# EAGLE design jphy_v2 (EAGLE 6.0)
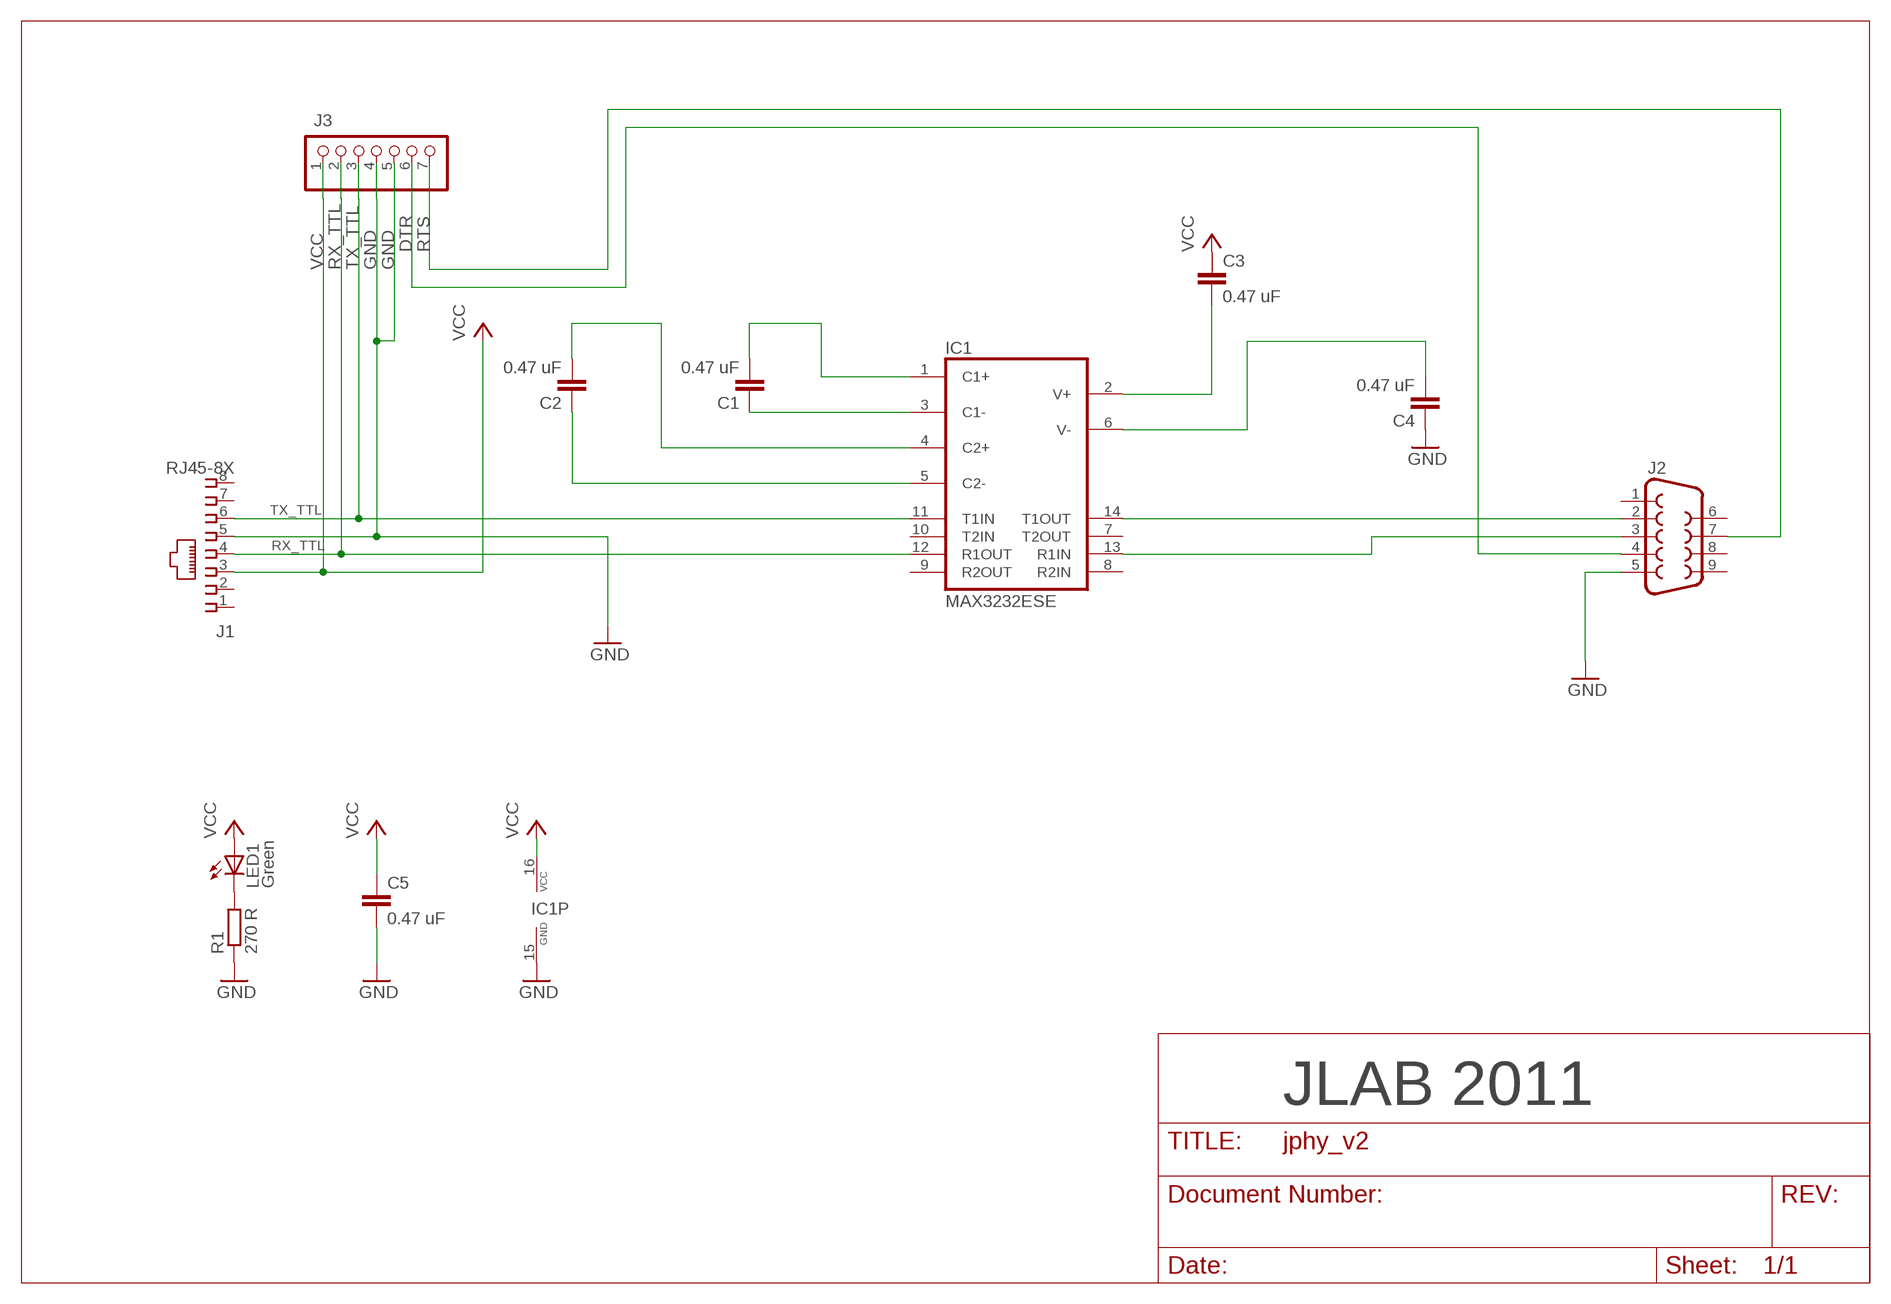
[diagram p0: schematic, sheet 1]

## Parts
C1  0.47 uF  C-EUC1206  [C1206]
C2  0.47 uF  C-EUC1206  [C1206]
C3  0.47 uF  C-EUC1206  [C1206]
C4  0.47 uF  C-EUC1206  [C1206]
C5  0.47 uF  C-EUC1206  [C1206]
IC1  MAX3232ESE  [SO16]
J1  RJ45-8X  [RJ45-NO-SHIELD]
J2  F09D  [F09D]
J3  PINHD-1X7  [1X07]
LED1  Green  LED3MM  [LED3MM]
R1  270 R  R-EU_0207/10  [0207/10]

## Nets
DTR: J2.4 J3.6
GND [power]: C4.1 C5.2 IC1.15(GND) J1.5 J2.5 J3.4 J3.5 R1.1
N$1: LED1.K(C) R1.2
N$2: C3.2 IC1.2(V+)
N$3: C4.2 IC1.6(V-)
N$4: C1.1 IC1.3(C1-)
N$5: C1.2 IC1.1(C1+)
N$6: C2.1 IC1.5(C2-)
N$7: C2.2 IC1.4(C2+)
N$10: IC1.14(T1OUT) J2.2
N$11: IC1.13(R1IN) J2.3
RTS: J2.7 J3.7
RX_TTL: IC1.12(R1OUT) J1.4 J3.2
TX_TTL: IC1.11(T1IN) J1.6 J3.3
VCC [power]: C3.1 C5.1 IC1.16(VCC) J1.3 J3.1 LED1.A
Unconnected: IC1.7(T2OUT) IC1.8(R2IN) IC1.9(R2OUT) IC1.10(T2IN) J1.1 J1.2 J1.7 J1.8 J2.1 J2.6 J2.8 J2.9

## Notes on the sheet
- JLAB 2011

## Library data of the parts
C1-C5 = rcl:C-EU: CAPACITOR, European symbol
IC1 = maxim:MAX3232*: True RS-232 Transceivers 3.0V to 5.5V, Low-Power up to 1Mbps, Using Four 0.1µF External Capacitors Source: http://pdfserv.maxim-ic.com/en/ds/MAX3222-MAX3241.pdf; MF: MAXIM; MPN: MAX3232ESE; OC_FARNELL: 9725539; OC_NEWARK: 79C3880
J1 = jlab:RJ45: CORCOM Modular RJ Jacks No Shield Source: www.tycoelectronics.com .. ENG_DS_1654001_1099_RJ_L_0507.pdf; MPN: RJ45-8X; OC_FARNELL: unknown; OC_NEWARK: 16R6101
J2 = con-subd:F09: SUB-D; OC_FARNELL: unknown; OC_NEWARK: unknown
J3 = pinhead:PINHD-1X7: PIN HEADER
LED1 = led:LED: LED OSRAM: - CHIPLED LG R971, LG N971, LY N971, LG Q971, LY Q971, LO R971, LY R971 LH N974, LH R974 LS Q976, LO Q976, LY Q976 LO Q996 - Hyper CHIPLED LW Q18S LB Q993, LB Q99A, LB R99A - SideLED LS A670, LO A670, LY A670, LG A670, LP A670 LB A673, LV A673, LT A673, LW A673 LH A674 LY A675 LS A676, LA A676, LO A676, LY A676, LW A676 LS A679, LY A679, LG A679 - Hyper Micro SIDELED® LS Y876, LA Y876, LO Y876, LY Y876 LT Y87S - SmartLED LW L88C, LW L88S LB L89C, LB L89S, LG L890 LS L89K, LO L89K, LY L89K LS L896, LA L896, LO L896, LY L896 - TOPLED LS T670, LO T670, LY T670, LG T670, LP T670 LSG T670, LSP T670, LSY T670, LOP T670, LYG T670 LG T671, LOG T671, LSG T671 LB T673, LV T673, LT T673, LW T673 LH T674 LS T676, LA T676, LO T676, LY T676, LB T676, LH T676, LSB T676, LW T676 LB T67C, LV T67C, LT T67C, LS T67K, LO T67K, LY T67K, LW E67C LS E67B, LA E67B, LO E67B, LY E67B, LB E67C, LV E67C, LT E67C LW T67C LS T679, LY T679, LG T679 LS T770, LO T770, LY T770, LG T770, LP T770 LB T773, LV T773, LT T773, LW T773 LH T774 LS E675, LA E675, LY E675, LS T675 LS T776, LA T776, LO T776, LY T776, LB T776 LHGB T686 LT T68C, LB T68C - Hyper Mini TOPLED® LB M676 - Mini TOPLED Santana® LG M470 LS M47K, LO M47K, LY M47K Source: http://www.osram.convergy.de LUXEON: - LUMILED® LXK2-PW12-R00, LXK2-PW12-S00, LXK2-PW14-U00, LXK2-PW14-V00 LXK2-PM12-R00, LXK2-PM12-S00, LXK2-PM14-U00 LXK2-PE12-Q00, LXK2-PE12-R00, LXK2-PE12-S00, LXK2-PE14-T00, LXK2-PE14-U00 LXK2-PB12-K00, LXK2-PB12-L00, LXK2-PB12-M00, LXK2-PB14-N00, LXK2-PB14-P00, LXK2-PB14-Q00 LXK2-PR12-L00, LXK2-PR12-M00, LXK2-PR14-Q00, LXK2-PR14-R00 LXK2-PD12-Q00, LXK2-PD12-R00, LXK2-PD12-S00 LXK2-PH12-R00, LXK2-PH12-S00 LXK2-PL12-P00, LXK2-PL12-Q00, LXK2-PL12-R00 Source: www.luxeon.com KINGBRIGHT: KA-3528ASYC Source: www.kingbright.com
R1 = rcl:R-EU_: RESISTOR, European symbol

## Net classes
0 default: width 0.254 mm, clearance 0.254 mm
1 power: width 0.813 mm, clearance 0.406 mm

## Board
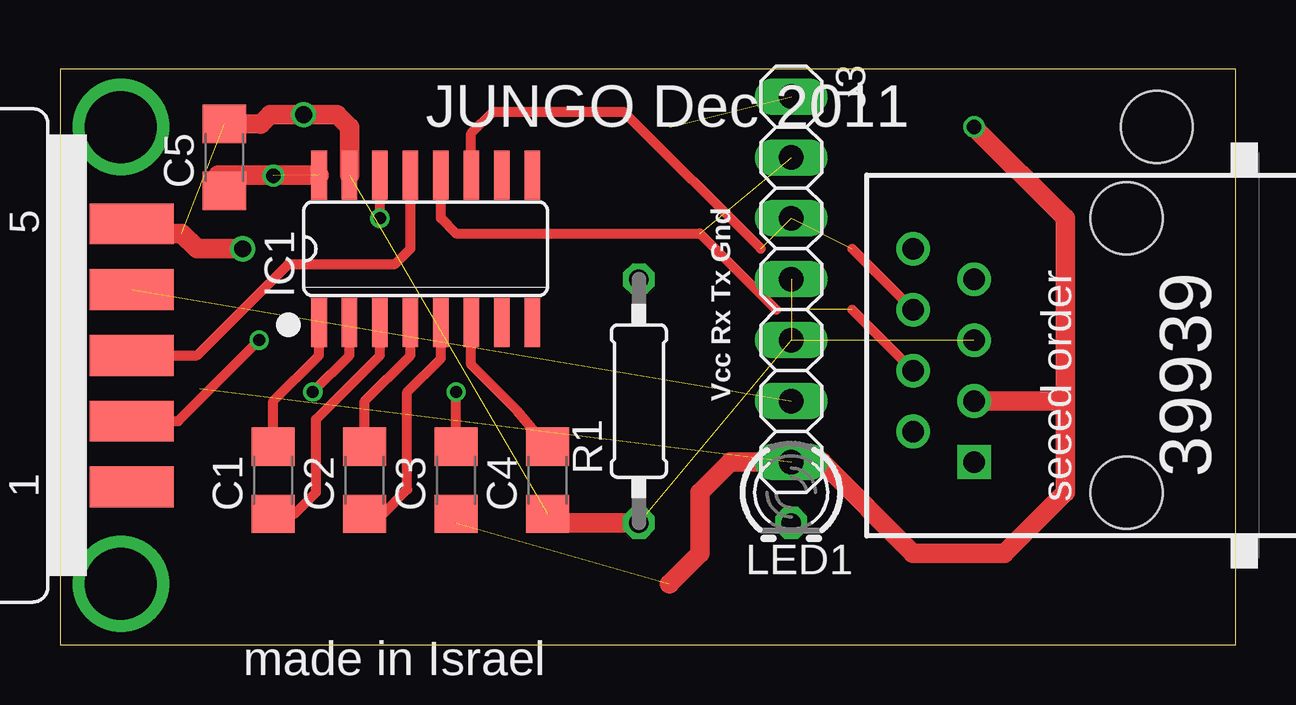
[diagram p1: board, top side]
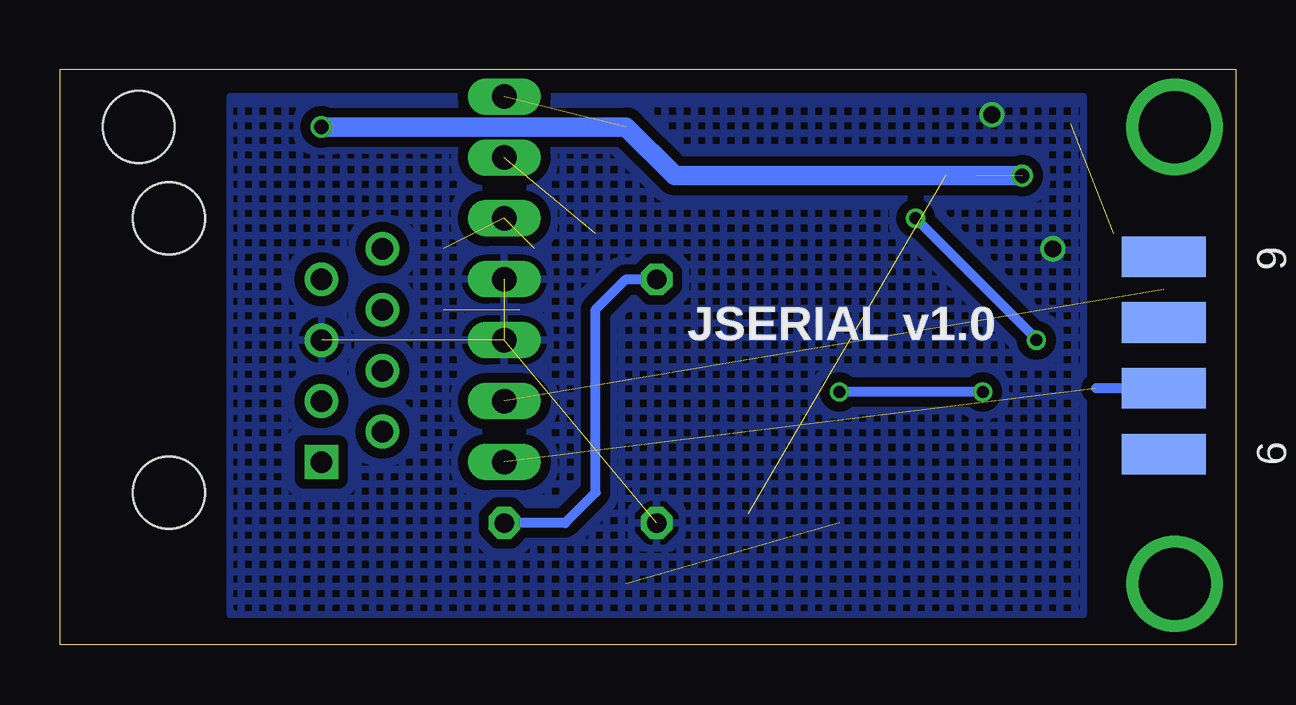
[diagram p2: board, bottom side, seen from below]

Size 49 x 24 mm. Coordinates in mm from the lower left corner, seen from the top.
Outline: 0,0 49,0 49,24 0,24 0,0
Copper layers (1*16): Top 0.035mm / dielectric 1.5mm / Bottom 0.035mm
Design rules: minimum track width 6mil, minimum drill 12mil, track to track 6mil, track to pad 6mil, pad to pad 6mil, via to via 6mil, smd to smd 0mil, copper to edge 10mil, drill to drill 10mil, minimum pad ring 10mil, minimum via ring 6mil, stop-mask expansion 2mil, vias tented up to drill 100mil, thermal gap 10mil
Holes 3 mm at 45.72,21.59

### Footprints (pad centres in the part's own frame; a part is rotated, then mirrored left to right if it is on the bottom)
C1206 = smd 1.6 x 1.8: 1 -1.4,0; 2 1.4,0
SO16 = smd 0.66 x 2.032: 1 -4.445,-3.073; 2 -3.175,-3.073; 3 -1.905,-3.073; 4 -0.635,-3.073; 5 0.635,-3.073; 6 1.905,-3.073; 7 3.175,-3.073; 8 4.445,-3.073; 9 4.445,3.073; 10 3.175,3.073; 11 1.905,3.073; 12 0.635,3.073; 13 -0.635,3.073; 14 -1.905,3.073; 15 -3.175,3.073; 16 -4.445,3.073
RJ45-NO-SHIELD = drill 0.9 pad 1.4 square: 1 -4.445,6.35 | drill 0.9 pad 1.4: 2 -3.175,8.89; 3 -1.905,6.35; 4 -0.635,8.89; 5 0.635,6.35; 6 1.905,8.89; 7 3.175,6.35; 8 4.445,8.89 | hole 3: -5.715,0; 5.715,0
F09D = smd 1.7 x 3.5: 1 -5.486,-6.045; 2 -2.743,-6.045; 3 0,-6.045; 4 2.743,-6.045; 5 5.486,-6.045 | smd 1.7 x 3.5 bottom: 6 -4.115,-6.045; 7 -1.372,-6.045; 8 1.372,-6.045; 9 4.115,-6.045
1X07 = drill 1.016 long: 1 -7.62,0; 2 -5.08,0; 3 -2.54,0; 4 0,0; 5 2.54,0; 6 5.08,0; 7 7.62,0
LED3MM = drill 0.813 octagon: A -1.27,0; K 1.27,0
0207/10 = drill 0.813 octagon: 1 -5.08,0; 2 5.08,0

### Placement (x,y rotation side)
C1  8.89,6.86 90 top
C2  12.7,6.86 90 top
C3  16.51,6.86 90 top
C4  20.32,6.86 90 top
C5  6.86,20.32 90 top
IC1  15.24,16.51 0 top
J1  44.45,12.06 90 top
J2  -3.05,12.06 90 top
J3  30.48,15.24 270 top
LED1  30.48,6.35 270 top
R1  24.13,10.16 90 top

### Tracks (layer width: path | path; a pad name or v marks a point on that pad's centre or on a via)
DTR  (1 unrouted)
GND  (via drill 0.7, 0.7 pad 0.25)  (5 unrouted)
  Top 0.813: J2.5 1.91,17.22 1.98,17.14 5.08,17.14 5.71,16.51 v7.62,16.51 | IC1.15 12.06,21.59 11.56,22.1 v10.16,22.1 8.76,22.1 8.37,21.7 C5.2 | R1.1 20.32,5.08 C4.1
  pour Bottom (hatched): 6.35,22.86 6.35,1.27 41.91,1.27 41.91,22.86
N$1
  Bottom 0.406: LED1.K 27.94,5.08 26.67,6.35 26.67,13.97 25.4,15.24 R1.2
N$2  (via drill 0.5)
  Top 0.406: v10.54,10.54 12.06,12.06 IC1.2 | C3.2 v16.51,10.54
  Bottom 0.406: v10.54,10.54 v16.51,10.54
N$3
  Top 0.406: IC1.6 17.14,11.68 19.05,9.78 C4.2
N$4
  Top 0.406: 8.76,5.46 C1.1 9.78,5.46 10.67,6.35 10.67,9.4 13.34,12.06 IC1.3
N$5
  Top 0.406: C1.2 8.89,10.16 10.79,12.06 IC1.1
N$6
  Top 0.406: C2.1 13.46,5.46 14.48,6.48 14.48,10.54 15.88,11.94 IC1.5
N$7
  Top 0.406: C2.2 12.7,10.16 14.61,12.06 IC1.4
N$8  (via drill 3 pad 2.54)
  other vias: 2.54,21.59
N$9  (via drill 3 pad 0.25)
  other vias: 2.54,2.54
N$10  (via drill 0.5)
  Top 0.406: v13.34,17.78 IC1.14 | v8.31,12.7 4.93,9.32 J2.2
  Bottom 0.406: v8.31,12.7 8.26,12.7 v13.34,17.78
N$11
  Top 0.406: IC1.13 14.61,16.51 13.97,15.88 9.53,15.88 5.71,12.06 J2.3
RTS  (1 unrouted)
  Bottom 0.406: J2.7 5.82,10.69
RX_TTL  (2 unrouted)
  Top 0.406: 33.02,13.97 J1.4 | IC1.12 15.88,17.78 16.51,17.14 26.67,17.14 29.84,13.97
TX_TTL  (2 unrouted)
  Top 0.406: 33.02,16.51 J1.6 | IC1.11 17.14,21.33 18.04,22.23 23.5,22.23 29.21,16.51
VCC  (via drill 0.6)  (3 unrouted)
  Top 0.813: 41.91,10.16 J1.3 | 41.91,10.16 41.91,6.35 39.37,3.81 35.56,3.81 31.75,7.62 LED1.A 27.94,7.62 26.67,6.35 26.67,3.81 25.4,2.54 | C5.1 6.6,19.58 IC1.16 | 41.91,10.16 41.91,17.78 v38.1,21.59 | 16.51,5.08 C3.1
  Bottom 0.813: v38.1,21.59 25.4,21.59 23.37,19.56 v8.89,19.56

### Text on the board
tNames: JUNGO Dec 2011 | Vcc Rx Tx Gnd | 39939 | seeed order | made in Israel
bNames: JSERIAL v1.0